# Altium schematic sheet led.SchDoc
size A3; Organization: Develer s.r.l.; Address1: via Mugellese 1/A; Address2: 50019 Campi Bisenzio; Address3: Firenze; Address4: ITALY; Revision: A; SheetNumber: 1; SheetTotal: 1
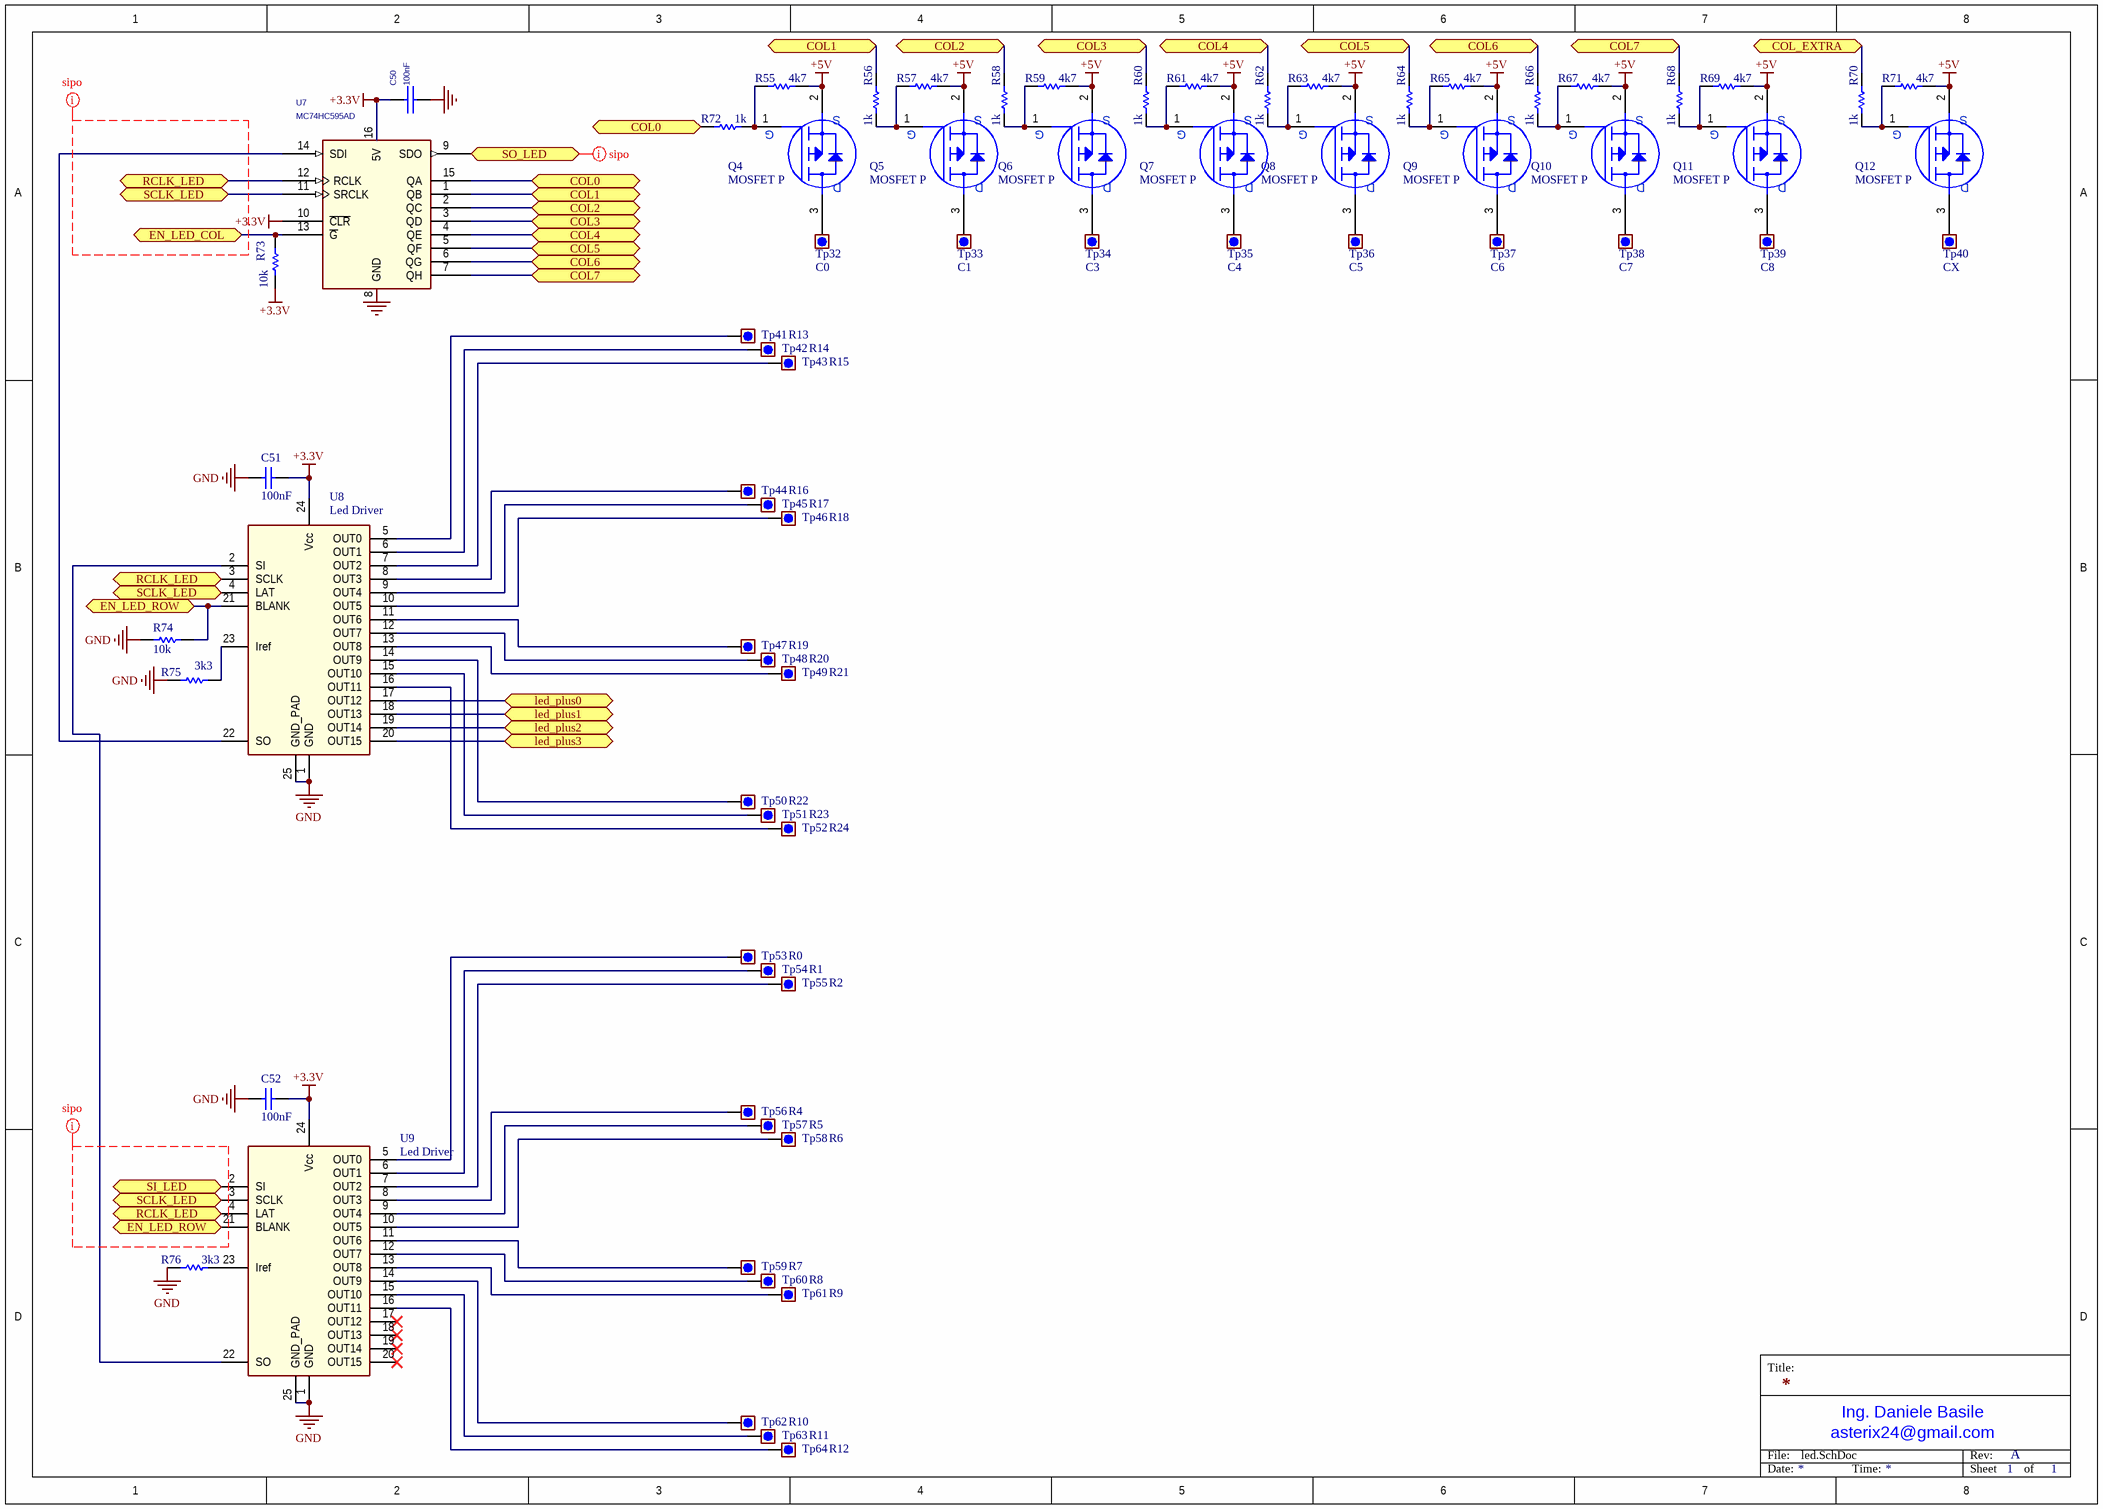
[diagram p0: led.SchDoc]

## Parts
C50  100nF  [0603_[1608]]
C51  100nF  [0603_[1608]]
C52  100nF  [0603_[1608]]
Q4  MOSFET P  [SOT-23]
Q5  MOSFET P  [SOT-23]
Q6  MOSFET P  [SOT-23]
Q7  MOSFET P  [SOT-23]
Q8  MOSFET P  [SOT-23]
Q9  MOSFET P  [SOT-23]
Q10  MOSFET P  [SOT-23]
Q11  MOSFET P  [SOT-23]
Q12  MOSFET P  [SOT-23]
R55  4k7  [0603_[1608]]
R56  1k  [0603_[1608]]
R57  4k7  [0603_[1608]]
R58  1k  [0603_[1608]]
R59  4k7  [0603_[1608]]
R60  1k  [0603_[1608]]
R61  4k7  [0603_[1608]]
R62  1k  [0603_[1608]]
R63  4k7  [0603_[1608]]
R64  1k  [0603_[1608]]
R65  4k7  [0603_[1608]]
R66  1k  [0603_[1608]]
R67  4k7  [0603_[1608]]
R68  1k  [0603_[1608]]
R69  4k7  [0603_[1608]]
R70  1k  [0603_[1608]]
R71  4k7  [0603_[1608]]
R72  1k  [0603_[1608]]
R73  10k  [0603_[1608]]
R74  10k  [0603_[1608]]
R75  3k3  [0805_[2012]]
R76  3k3  [0805_[2012]]
Tp32  C0  [TEST_POINT_THD_D1.6mm_oval]  (no BOM)
Tp33  C1  [TEST_POINT_THD_D1.6mm_oval]  (no BOM)
Tp34  C3  [TEST_POINT_THD_D1.6mm_oval]  (no BOM)
Tp35  C4  [TEST_POINT_THD_D1.6mm_oval]  (no BOM)
Tp36  C5  [TEST_POINT_THD_D1.6mm_oval]  (no BOM)
Tp37  C6  [TEST_POINT_THD_D1.6mm_oval]  (no BOM)
Tp38  C7  [TEST_POINT_THD_D1.6mm_oval]  (no BOM)
Tp39  C8  [TEST_POINT_THD_D1.6mm_oval]  (no BOM)
Tp40  CX  [TEST_POINT_THD_D1.6mm_oval]  (no BOM)
Tp41  R13  [TEST_POINT_THD_D1.6mm_oval]  (no BOM)
Tp42  R14  [TEST_POINT_THD_D1.6mm_oval]  (no BOM)
Tp43  R15  [TEST_POINT_THD_D1.6mm_oval]  (no BOM)
Tp44  R16  [TEST_POINT_THD_D1.6mm_oval]  (no BOM)
Tp45  R17  [TEST_POINT_THD_D1.6mm_oval]  (no BOM)
Tp46  R18  [TEST_POINT_THD_D1.6mm_oval]  (no BOM)
Tp47  R19  [TEST_POINT_THD_D1.6mm_oval]  (no BOM)
Tp48  R20  [TEST_POINT_THD_D1.6mm_oval]  (no BOM)
Tp49  R21  [TEST_POINT_THD_D1.6mm_oval]  (no BOM)
Tp50  R22  [TEST_POINT_THD_D1.6mm_oval]  (no BOM)
Tp51  R23  [TEST_POINT_THD_D1.6mm_oval]  (no BOM)
Tp52  R24  [TEST_POINT_THD_D1.6mm_oval]  (no BOM)
Tp53  R0  [TEST_POINT_THD_D1.6mm_oval]  (no BOM)
Tp54  R1  [TEST_POINT_THD_D1.6mm_oval]  (no BOM)
Tp55  R2  [TEST_POINT_THD_D1.6mm_oval]  (no BOM)
Tp56  R4  [TEST_POINT_THD_D1.6mm_oval]  (no BOM)
Tp57  R5  [TEST_POINT_THD_D1.6mm_oval]  (no BOM)
Tp58  R6  [TEST_POINT_THD_D1.6mm_oval]  (no BOM)
Tp59  R7  [TEST_POINT_THD_D1.6mm_oval]  (no BOM)
Tp60  R8  [TEST_POINT_THD_D1.6mm_oval]  (no BOM)
Tp61  R9  [TEST_POINT_THD_D1.6mm_oval]  (no BOM)
Tp62  R10  [TEST_POINT_THD_D1.6mm_oval]  (no BOM)
Tp63  R11  [TEST_POINT_THD_D1.6mm_oval]  (no BOM)
Tp64  R12  [TEST_POINT_THD_D1.6mm_oval]  (no BOM)
U7  MC74HC595AD  [SOIC16]
U8  Led Driver  [TSOP65P640X120_HS-25N]
U9  Led Driver  [TSOP65P640X120_HS-25N]

## Ports
COL0, COL1, COL2, COL3, COL4, COL5, COL6, COL7, COL_EXTRA, EN_LED_COL, EN_LED_ROW, led_plus0, led_plus1, led_plus2, led_plus3, RCLK_LED, SCLK_LED, SI_LED, SO_LED

## Nets
+3.3V: C50.1 C51.2 C52.2 R73.1 U7.10(~{CLR}) U7.16(5V) U8.24(Vcc) U9.24(Vcc)  [also labelled 5V]
+5V: Q4.2(S) Q5.2(S) Q6.2(S) Q7.2(S) Q8.2(S) Q9.2(S) Q10.2(S) Q11.2(S) Q12.2(S) R55.1 R57.1 R59.1 R61.1 R63.1 R65.1 R67.1 R69.1 R71.1
GND: C50.2 C51.1 C52.1 R74.1 R75.1 R76.1 U7.8(GND) U8.1(GND) U8.25(GND_PAD) U9.1(GND) U9.25(GND_PAD)
COL0: R72.2 U7.15(QA) ; port COL0
COL1: R56.1 U7.1(QB) ; port COL1
COL2: R58.1 U7.2(QC) ; port COL2
COL3: R60.1 U7.3(QD) ; port COL3
COL4: R62.1 U7.4(QE) ; port COL4
COL5: R64.1 U7.5(QF) ; port COL5
COL6: R66.1 U7.6(QG) ; port COL6
COL7: R68.1 U7.7(QH) ; port COL7
COL_EXTRA: R70.1 ; port COL_EXTRA
EN_LED_COL: R73.2 U7.13(~{G}) ; port EN_LED_COL
EN_LED_ROW: R74.2 U8.21(BLANK) U9.21(BLANK) ; port EN_LED_ROW
led_plus0: U8.17(OUT12) ; port led_plus0
led_plus1: U8.18(OUT13) ; port led_plus1
led_plus2: U8.19(OUT14) ; port led_plus2
led_plus3: U8.20(OUT15) ; port led_plus3
RCLK_LED: U7.12(RCLK) U8.3(SCLK) U9.4(LAT) ; port RCLK_LED
SCLK_LED: U7.11(SRCLK) U8.4(LAT) U9.3(SCLK) ; port SCLK_LED
SI_LED: U9.2(SI) ; port SI_LED
SO_LED: U7.9(SDO) ; port SO_LED
NetQ4_1: Q4.1(G) R55.2 R72.1
NetQ4_3: Q4.3(D) Tp32.1
NetQ5_1: Q5.1(G) R56.2 R57.2
NetQ5_3: Q5.3(D) Tp33.1
NetQ6_1: Q6.1(G) R58.2 R59.2
NetQ6_3: Q6.3(D) Tp34.1
NetQ7_1: Q7.1(G) R60.2 R61.2
NetQ7_3: Q7.3(D) Tp35.1
NetQ8_1: Q8.1(G) R62.2 R63.2
NetQ8_3: Q8.3(D) Tp36.1
NetQ9_1: Q9.1(G) R64.2 R65.2
NetQ9_3: Q9.3(D) Tp37.1
NetQ10_1: Q10.1(G) R66.2 R67.2
NetQ10_3: Q10.3(D) Tp38.1
NetQ11_1: Q11.1(G) R68.2 R69.2
NetQ11_3: Q11.3(D) Tp39.1
NetQ12_1: Q12.1(G) R70.2 R71.2
NetQ12_3: Q12.3(D) Tp40.1
NetR75_2: R75.2 U8.23(Iref)
NetR76_2: R76.2 U9.23(Iref)
NetTp41_1: Tp41.1 U8.5(OUT0)
NetTp42_1: Tp42.1 U8.6(OUT1)
NetTp43_1: Tp43.1 U8.7(OUT2)
NetTp44_1: Tp44.1 U8.8(OUT3)
NetTp45_1: Tp45.1 U8.9(OUT4)
NetTp46_1: Tp46.1 U8.10(OUT5)
NetTp47_1: Tp47.1 U8.11(OUT6)
NetTp48_1: Tp48.1 U8.12(OUT7)
NetTp49_1: Tp49.1 U8.13(OUT8)
NetTp50_1: Tp50.1 U8.14(OUT9)
NetTp51_1: Tp51.1 U8.15(OUT10)
NetTp52_1: Tp52.1 U8.16(OUT11)
NetTp53_1: Tp53.1 U9.5(OUT0)
NetTp54_1: Tp54.1 U9.6(OUT1)
NetTp55_1: Tp55.1 U9.7(OUT2)
NetTp56_1: Tp56.1 U9.8(OUT3)
NetTp57_1: Tp57.1 U9.9(OUT4)
NetTp58_1: Tp58.1 U9.10(OUT5)
NetTp59_1: Tp59.1 U9.11(OUT6)
NetTp60_1: Tp60.1 U9.12(OUT7)
NetTp61_1: Tp61.1 U9.13(OUT8)
NetTp62_1: Tp62.1 U9.14(OUT9)
NetTp63_1: Tp63.1 U9.15(OUT10)
NetTp64_1: Tp64.1 U9.16(OUT11)
NetU7_14: U7.14(SDI) U8.22(SO)
NetU8_2: U8.2(SI) U9.22(SO)

Not connected (* = marked no-connect by the designer): U9 17(OUT12)* 18(OUT13)* 19(OUT14)* 20(OUT15)*

## Layout directives
net class sipo: (no net found under the mark), SO_LED

## Notes on the sheet
- Title:
- File:
- asterix24@gmail.com
- Ing. Daniele Basile
- Rev:
- Date:
- Time:
- Sheet
- of

## Library data of the parts
C50 = C: CER 50V X7R
C51 C52 = Cap: Ceramic X7R 50V; Value: 10nF; Published: 8-Jun-2000; Revision: July-2002: Re-released for DXP Platform.; Publisher: Altium Limited
Q4 = MOSFET-P 3pin: IRLML5103TRPbF; DMG1013UW;
Q5-Q12 = MOSFET-P 3pin
R55 R57 R59 R61 R63 R65 R67 R69 R71 R73-R76 = Res1: Resistor; Value: 1K; Published: 8-Jun-2000; Revision: July-2002: Re-released for DXP Platform.; Publisher: Altium Limited
R56 R58 R60 R62 R64 R66 R68 R70 R72 = Res1: Resistor; Published: 8-Jun-2000; Revision: July-2002: Re-released for DXP Platform.; Publisher: Altium Limited; Value: 1K
Tp32-Tp64 = Test_point: Test point
U7 = 74HC595_27: 8-Bit Serial-Input/Serial or Prallel-Output Shift Register with Latched 3-State Outputs
U8 U9 = Led_driver: (Texas TLC5928; ST STP16CP05)